# Altium schematic sheet quick example.SchDoc
size A; SheetNumber: 1; SheetTotal: 1
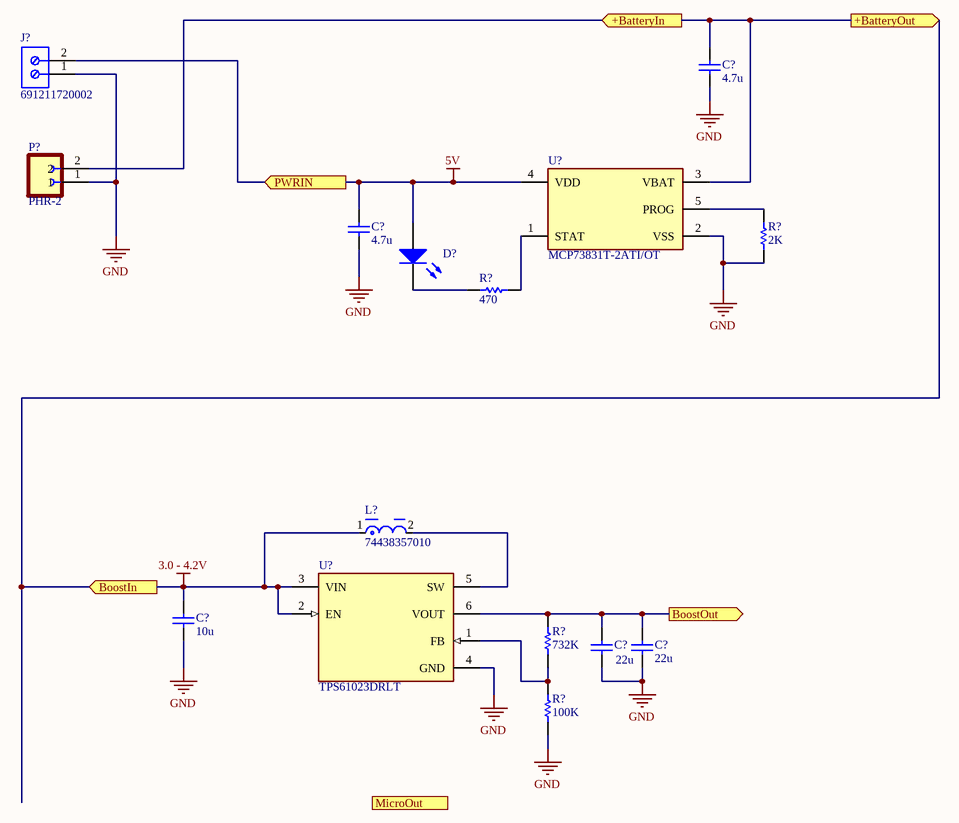
[diagram p0: quick example.SchDoc]

## Parts
(Parts that share a designator on the sheet are numbered #1, #2 ... from top to bottom, then left to right.)
C?#1  value 4.7u  (hidden comment: Capacitor)
C?#2  value 4.7u  (hidden comment: Capacitor)
C?#3  value 10u  (hidden comment: Capacitor)
C?#4  value 22u  (hidden comment: Capacitor)
C?#5  value 22u  (hidden comment: Capacitor)
D?  Light-Emitting Diode  (value not drawn)
J?  691211720002  [691211720002]
L?  74438357010  [FP-74438357010-MFG]
P?  PHR-2  [JST_PHR-2]
R?#1  value 2K  (hidden comment: Resistor)
R?#2  value 470  (hidden comment: Resistor)
R?#3  value 732K  (hidden comment: Resistor)
R?#4  value 100K  (hidden comment: Resistor)
U?#1  MCP73831T-2ATI/OT  [FP-C04-091-OT-IPC_C]
U?#2  TPS61023DRLT  [FP-DRL0006A-MFG]

## Ports
+BatteryIn (in), +BatteryOut (out), BoostIn (in), BoostOut (out), MicroOut (out), PWRIN (in)

## Nets
3.0 - 4.2V: C?#1.2 C?#3.2 L?.1 P?.2 U?#1.3(VBAT) U?#2.2(EN) U?#2.3(VIN) ; port +BatteryIn, port +BatteryOut, port BoostIn
5V: C?#2.2 D?.1(A) J?.2 U?#1.4(VDD) ; port PWRIN
GND: C?#1.1 C?#2.1 C?#3.1 C?#4.1 C?#5.1 J?.1 P?.1 R?#1.1 R?#4.1 U?#1.2(VSS) U?#2.4(GND)
BoostOut: C?#4.2 C?#5.2 R?#3.2 U?#2.6(VOUT) ; port BoostOut
NetD?_2: D?.2(K) R?#2.2
NetL?_2: L?.2 U?#2.5(SW)
NetR?#1_2: R?#1.2 U?#1.5(PROG)
NetR?#2_1: R?#2.1 U?#1.1(STAT)
NetR?#3_1: R?#3.1 R?#4.2 U?#2.1(FB)

## Library data of the parts
C?#1-C?#5 = Capacitor: SimulationGenericComponent: True
D? = LED: AF: 1; BV: 0; BV_MAX: 1e99; EG: 1.11; FC: 0.5; IBV: 0.001; IS: 1e-14; MJSW: 0.33; NTUN: 30; TNOM: 27; XTI: 3; SimulationGenericComponent: True; CJO: 0; CJP: 0; CTA: 0; CTP: 0; FCS: 0.5; FV_MAX: 1e99; IKF: 0; IKR: 0; ISR: 1e-14; JSW: 0; JTUN: 0; JTUNSW: 0; KEG: 1; KF: 0; LEVEL: 1; N: 1; NBV: 1; NR: 1; NS: 1; PHP: 1; RS: 0; TCV: 0; TLEV: 0; TLEVC: 0; TM1: 0; TM2: 0; TPB: 0; TPHP: 0; TRS: 0; TRS2: 0; TT: 0; TTT1: 0; TTT2: 0; VJ: 1; XTITUN: 3
J? = CMP-1502-02524-1: Serie 211 - 5.00 mm 45deg Entry Modular with Rising Cage Clamp - 15.50 mm Height WR-TBL, 2 pin; Manufacturer: Wurth Elektronik; Pitch: 5.00mm; Pin Number: 2; Manufacturer URL: http://www.we-online.de; Mounting Technology: THT; Packaging: Box; Datasheet URL: http://katalog.we-online.de/em/datasheet/6912117200xx.pdf; Operating Temperature: -40to105degC; Package Reference: 691211720002; Part Number: 691211720002; Publisher: WurthElektronik
L? = CMP-207846-000056-1: FIXED IND 1UH 7.4A 13.5 MOHM SMD; Shielding: Shielded; DC Resistance (DCR): 13.5mR; Core Material: Metal; Test Frequency: 100kHz; Self Resonant Frequency: 59MHz; Tolerance: 20%; Saturation Current: 9.6A; Packaging: Cut Tape; Mount: Surface Mount; Min Operating Temperature: -40°C; RoHS Compliant: Yes; Max Operating Temperature: 125°C; Case/Package: Nonstandard; Current Rating: 7.4A; Inductance: 1uH; Value: 1uH
P? = PHR-2: PH Series 2 Position 2 mm Pitch Free Hanging Housing Connector; Value: *; MP: PHR-2; Package: None; Availability: Unavailable; Price: None
R?#1-R?#4 = Resistor: TC1: 0; SimulationGenericComponent: True; TC2: 0
U?#1 = CMP-0133-00144-2: IC CONTROLLR LI-ION 4.2V SOT23-5; Max Supply Voltage: 6V; Max Output Current: 500mA; Min Output Voltage: 4.168V; Max Output Voltage: 4.232V; Min Supply Voltage: 3.75V; Number of Cells: 1; Lead Free: Lead Free; Number of Pins: 5; Package Quantity: 3000; Min Operating Temperature: -40°C; Width: 1.8mm; Max Charge Current: 500mA; Output Current: 500mA; Packaging: Tape and Reel; Height: 1.3mm; Output Voltage: 4.2V; Max Operating Temperature: 85°C; Mount: Surface Mount; Case/Package: SOT-23; Length: 3.1mm; REACH SVHC: No SVHC
U?#2 = CMP-04918-000657-1: IC REG BOOST ADJ 3A SOT563